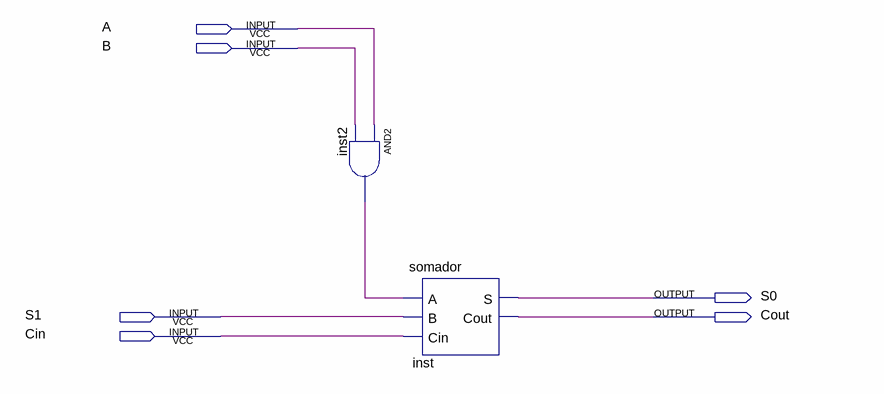
[diagram p0: schematic sheet]
// Quartus schematic mult.bdf as structural Verilog: 2 symbols, 6 pins
module mult (
  input  A,
  input  B,
  input  S1,
  input  Cin,
  output S0,
  output Cout
);

  wire inst2_out;

  and inst2 (inst2_out, A, B);
  somador inst (.A(inst2_out), .B(S1), .Cin(Cin), .S(S0), .Cout(Cout));
endmodule
